# Altium schematic sheet CPU_LPC1776.SchDoc: =ProjectName
size 420 x 297 mm; Author: T.P.; CompanyName: WUT; DrawnBy: T.P.; Organization: WUT ISE; Address1: Warsaw Univeristy of Technology; Address2: Nowowiejska 15/19; DocumentNumber: 2; Revision: 0.9; SheetNumber: 2; SheetTotal: 36; EDA_Number: ARTIQ; Projet: ARTIQ/SINARA; ModifiedBy: -; CreateDate: XX/XX/XXXX; CheckedDate: -; Title2: CPU_LPC1776.SchDoc; DivGrp: ISE; Designer: G.K. and T.P.; ModifiedDate: -; ProjectName: ADC/DAC MEZZANINE
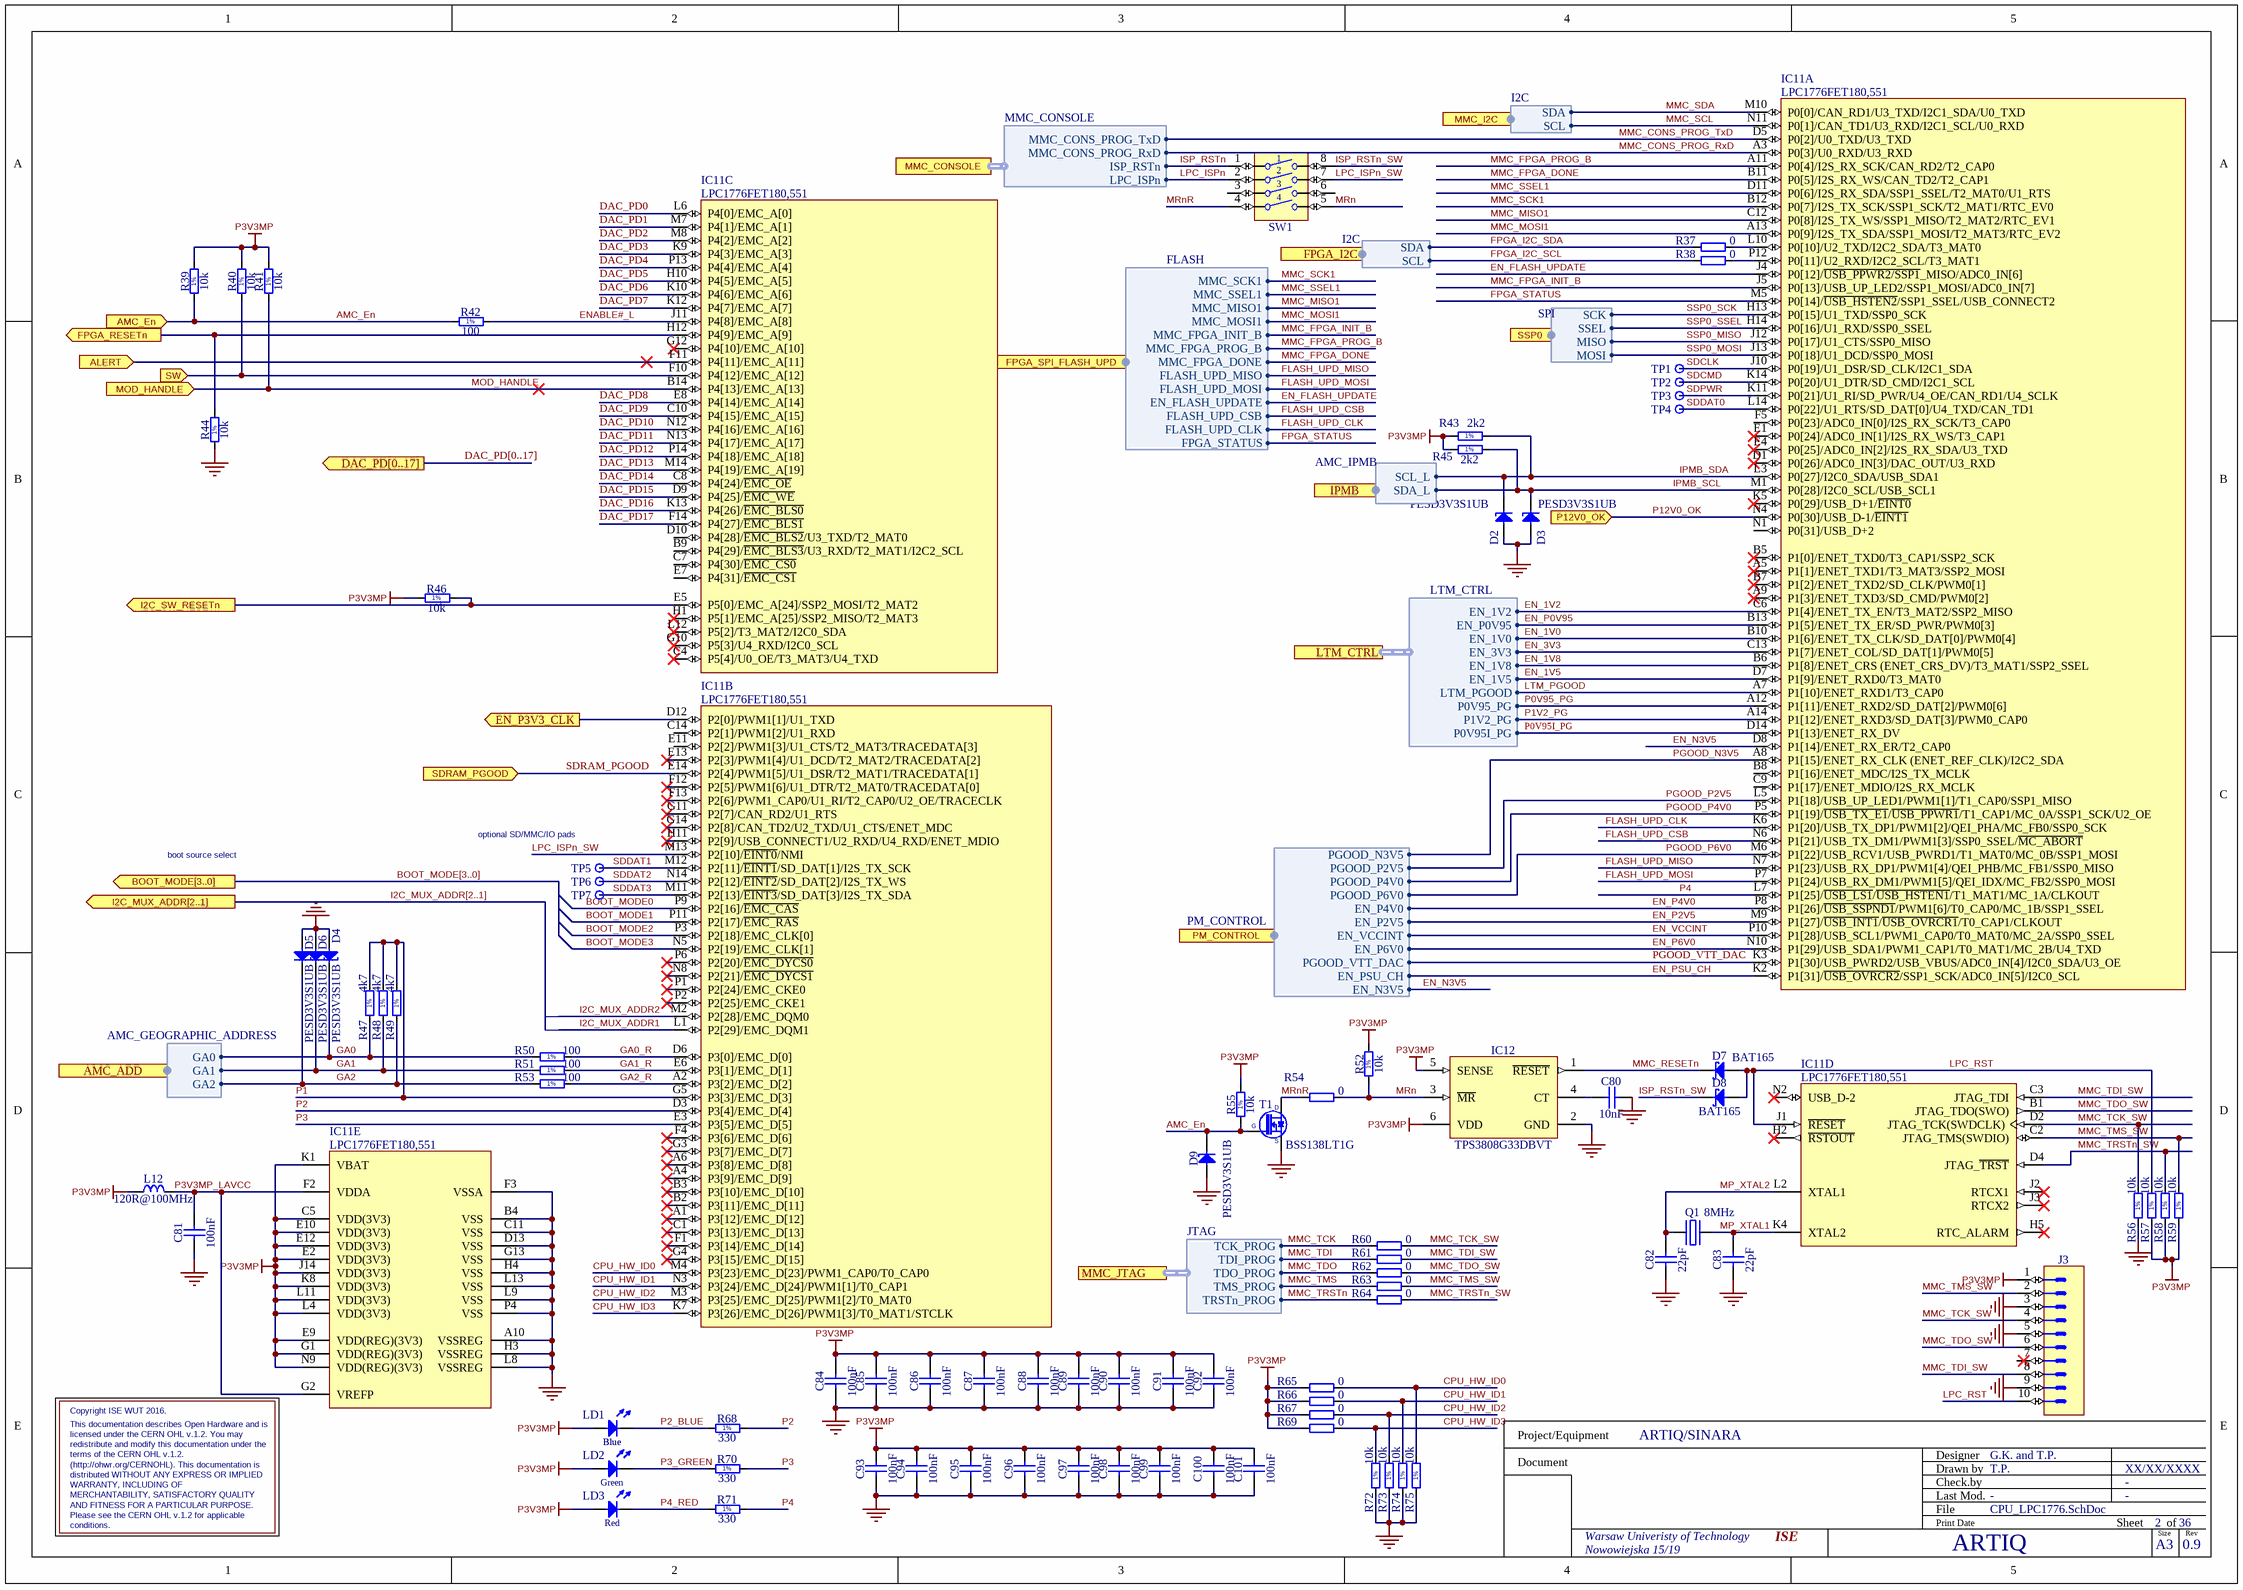
[diagram p0: CPU_LPC1776.SchDoc]

## Parts
C80  10nF  [CAPC1005X55N]
C81  100nF  [CAPC0603X33N]
C82  22pF  [CAPC1005X55N]
C83  22pF  [CAPC1005X55N]
C84  100nF  [CAPC0603X33N]
C85  100nF  [CAPC0603X33N]
C86  100nF  [CAPC0603X33N]
C87  100nF  [CAPC0603X33N]
C88  100nF  [CAPC0603X33N]
C89  100nF  [CAPC0603X33N]
C90  100nF  [CAPC0603X33N]
C91  100nF  [CAPC0603X33N]
C92  100nF  [CAPC0603X33N]
C93  100nF  [CAPC0603X33N]
C94  100nF  [CAPC0603X33N]
C95  100nF  [CAPC0603X33N]
C96  100nF  [CAPC0603X33N]
C97  100nF  [CAPC0603X33N]
C98  100nF  [CAPC0603X33N]
C99  100nF  [CAPC0603X33N]
C100  100nF  [CAPC0603X33N]
C101  100nF  [CAPC0603X33N]
D2  PESD3V3S1UB  [SODFL1608X65N]
D3  PESD3V3S1UB  [SODFL1608X65N]
D4  PESD3V3S1UB  [SODFL1608X65N]
D5  PESD3V3S1UB  [SODFL1608X65N]
D6  PESD3V3S1UB  [SODFL1608X65N]
D7  BAT165  [SOD2512X110N]
D8  BAT165  [SOD2512X110N]
D9  PESD3V3S1UB  [SODFL1608X65N]
IC11  LPC1776FET180,551  [BGA180C80P14X14_1200X1200X120]  (parts A,B,C,D,E of 5)
IC12  TPS3808G33DBVT  [SOT95P280X145-6N]
J3  Header 10  [SAMTEC_FTS-105-02-F-DV]  (value not drawn)
L12  120R@100MHz  [INDC1608X95N]
LD1  Blue  [LED_AVAGO_HSMR-C120]
LD2  Green  [LED_AVAGO_HSME-C120]
LD3  Red  [LED_OSRAM_LS Q976]
Q1  8MHz  [XTAL_TXC_7A]
R37  0  [RESC1005X40N]
R38  0  [RESC1005X40N]
R39  10k  [RESC1005X40N]
R40  10k  [RESC1005X40N]
R41  10k  [RESC1005X40N]
R42  100  [RESC1005X40N]
R43  2k2  [RESC1005X40N]
R44  10k  [RESC1005X40N]
R45  2k2  [RESC1005X40N]
R46  10k  [RESC1005X40N]
R47  4k7  [RESC1005X40N]
R48  4k7  [RESC1005X40N]
R49  4k7  [RESC1005X40N]
R50  100  [RESC1005X40N]
R51  100  [RESC1005X40N]
R52  10k  [RESC1005X40N]
R53  100  [RESC1005X40N]
R54  0  [RESC1005X40N]
R55  10k  [RESC1005X40N]
R56  10k  [RESC1005X40N]
R57  10k  [RESC1005X40N]
R58  10k  [RESC1005X40N]
R59  10k  [RESC1005X40N]
R60  0  [RESC1005X40N]
R61  0  [RESC1005X40N]
R62  0  [RESC1005X40N]
R63  0  [RESC1005X40N]
R64  0  [RESC1005X40N]
R65  0  [RESC1005X40N]
R66  0  [RESC1005X40N]
R67  0  [RESC1005X40N]
R68  330  [RESC1005X40N]
R69  0  [RESC1005X40N]
R70  330  [RESC1005X40N]
R71  330  [RESC1005X40N]
R72  10k  [RESC1005X40N]
R73  10k  [RESC1005X40N]
R74  10k  [RESC1005X40N]
R75  10k  [RESC1005X40N]
SW1  Switch  [SW_TYCO_1571983-4]  (value not drawn)
T1  BSS138LT1G  [SOT95P240X110-3N]
TP1  Test Point  [TPS127]  (value not drawn)
TP2  Test Point  [TPS127]  (value not drawn)
TP3  Test Point  [TPS127]  (value not drawn)
TP4  Test Point  [TPS127]  (value not drawn)
TP5  Test Point  [TPS127]  (value not drawn)
TP6  Test Point  [TPS127]  (value not drawn)
TP7  Test Point  [TPS127]  (value not drawn)

## Ports
ALERT (in), AMC_ADD (harness AMC_GEOGRAPHIC_ADDRESS), AMC_En (in), BOOT_MODE[3..0] (out), DAC_PD[0..17] (out), EN_P3V3_CLK (out), FPGA_I2C (harness I2C), FPGA_RESETn (out), FPGA_SPI_FLASH_UPD (harness FLASH), I2C_MUX_ADDR[2..1] (out), I2C_SW_RESETn (out), IPMB (harness AMC_IPMB), LTM_CTRL (harness LTM_CTRL), MMC_CONSOLE (harness MMC_CONSOLE), MMC_I2C (harness I2C), MMC_JTAG (harness JTAG), MOD_HANDLE (in), P12V0_OK (in), PM_CONTROL (harness PM_CONTROL), SDRAM_PGOOD (in), SSP0 (harness SPI), SW (in)

## Harnesses
I2C: SDA, SCL
AMC_GEOGRAPHIC_ADDRESS: GA0, GA1, GA2
PM_CONTROL: EN_P6V0, EN_PSU_CH, EN_VCCINT, PGOOD_P6V0, EN_P4V0, EN_P2V5, PGOOD_P4V0, PGOOD_P2V5, PGOOD_VTT_DAC, EN_N3V5, PGOOD_N3V5
SPI: SCK, SSEL, MISO, MOSI
FLASH: MMC_SCK1, MMC_SSEL1, MMC_MISO1, MMC_MOSI1, MMC_FPGA_INIT_B, MMC_FPGA_PROG_B, MMC_FPGA_DONE, FLASH_UPD_MISO, FLASH_UPD_MOSI, EN_FLASH_UPDATE, FLASH_UPD_CSB, FLASH_UPD_CLK, FPGA_STATUS
MMC_CONSOLE: MMC_CONS_PROG_RxD, MMC_CONS_PROG_TxD, LPC_ISPn, ISP_RSTn
I2C: SCL, SDA
AMC_IPMB: SCL_L, SDA_L
JTAG: TDO_PROG, TDI_PROG, TCK_PROG, TMS_PROG, TRSTn_PROG
LTM_CTRL: EN_1V0, EN_3V3, EN_1V8, EN_1V5, LTM_PGOOD, EN_1V2, EN_P0V95, P0V95_PG, P1V2_PG, P0V95I_PG

## Nets
GND: C80.1 C81.2 C82.1 C83.1 C84.2 C85.2 C86.2 C87.2 C88.2 C89.2 C90.2 C91.2 C92.2 C93.2 C94.2 C95.2 C96.2 C97.2 C98.2 C99.2 C100.2 C101.2 D2.2(A) D3.2(A) D4.2(A) D5.2(A) D6.2(A) D9.2(A) IC11.A10(VSSREG) IC11.B4(VSS) IC11.C11(VSS) IC11.D13(VSS) IC11.F3(VSSA) IC11.G13(VSS) IC11.H3(VSSREG) IC11.H4(VSS) IC11.L8(VSSREG) IC11.L9(VSS) IC11.L13(VSS) IC11.P4(VSS) IC12.2(GND) J3.3 J3.5 J3.9 R44.1 R56.1 R72.1 R73.1 R74.1 R75.1 T1.2(S)
P3V3MP: C84.1 C85.1 C86.1 C87.1 C88.1 C89.1 C90.1 C91.1 C92.1 C93.1 C94.1 C95.1 C96.1 C97.1 C98.1 C99.1 C100.1 C101.1 IC11.C5(VDD(3V3)) IC11.E2(VDD(3V3)) IC11.E9(VDD(REG)(3V3)) IC11.E10(VDD(3V3)) IC11.E12(VDD(3V3)) IC11.G1(VDD(REG)(3V3)) IC11.J14(VDD(3V3)) IC11.K1(VBAT) IC11.K8(VDD(3V3)) IC11.L4(VDD(3V3)) IC11.L11(VDD(3V3)) IC11.N9(VDD(REG)(3V3)) IC12.5(SENSE) IC12.6(VDD) J3.1 L12.2 LD1.2(A) LD2.2(A) LD3.2(A) R39.2 R40.2 R41.2 R43.1 R45.1 R46.1 R52.2 R55.2 R57.1 R58.1 R59.1 R65.1 R66.1 R67.1 R69.1
ALERT: IC11.F11(P4[11]/EMC_A[11]) ; port ALERT
AMC_En: D9.1(C) R39.1 R42.1 R55.1 T1.1(G) ; port AMC_En
BOOT_MODE0: IC11.P9(P2[16]/~{EMC_CAS})
BOOT_MODE1: IC11.P11(P2[17]/~{EMC_RAS})
BOOT_MODE2: IC11.P3(P2[18]/EMC_CLK[0])
BOOT_MODE3: IC11.N5(P2[19]/EMC_CLK[1])
CPU_HW_ID0: IC11.M4(P3[23]/EMC_D[23]/PWM1_CAP0/T0_CAP0) R65.2 R75.2
CPU_HW_ID1: IC11.N3(P3[24]/EMC_D[24]/PWM1[1]/T0_CAP1) R66.2 R74.2
CPU_HW_ID2: IC11.M3(P3[25]/EMC_D[25]/PWM1[2]/T0_MAT0) R67.2 R73.2
CPU_HW_ID3: IC11.K7(P3[26]/EMC_D[26]/PWM1[3]/T0_MAT1/STCLK) R69.2 R72.2
DAC_PD0: IC11.L6(P4[0]/EMC_A[0])
DAC_PD1: IC11.M7(P4[1]/EMC_A[1])
DAC_PD2: IC11.M8(P4[2]/EMC_A[2])
DAC_PD3: IC11.K9(P4[3]/EMC_A[3])
DAC_PD4: IC11.P13(P4[4]/EMC_A[4])
DAC_PD5: IC11.H10(P4[5]/EMC_A[5])
DAC_PD6: IC11.K10(P4[6]/EMC_A[6])
DAC_PD7: IC11.K12(P4[7]/EMC_A[7])
DAC_PD8: IC11.E8(P4[14]/EMC_A[14])
DAC_PD9: IC11.C10(P4[15]/EMC_A[15])
DAC_PD10: IC11.N12(P4[16]/EMC_A[16])
DAC_PD11: IC11.N13(P4[17]/EMC_A[17])
DAC_PD12: IC11.P14(P4[18]/EMC_A[18])
DAC_PD13: IC11.M14(P4[19]/EMC_A[19])
DAC_PD14: IC11.C8(P4[24]/~{EMC_OE})
DAC_PD15: IC11.D9(P4[25]/~{EMC_WE})
DAC_PD16: IC11.K13(P4[26]/~{EMC_BLS0})
DAC_PD17: IC11.F14(P4[27]/~{EMC_BLS1})
EN_1V0: IC11.B10(P1[6]/ENET_TX_CLK/SD_DAT[0]/PWM0[4]) ; port LTM_CTRL.EN_1V0
EN_1V2: IC11.C6(P1[4]/ENET_TX_EN/T3_MAT2/SSP2_MISO) ; port LTM_CTRL.EN_1V2
EN_1V5: IC11.D7(P1[9]/ENET_RXD0/T3_MAT0) ; port LTM_CTRL.EN_1V5
EN_1V8: IC11.B6(P1[8]/ENET_CRS_(ENET_CRS_DV)/T3_MAT1/SSP2_SSEL) ; port LTM_CTRL.EN_1V8
EN_3V3: IC11.C13(P1[7]/ENET_COL/SD_DAT[1]/PWM0[5]) ; port LTM_CTRL.EN_3V3
EN_FLASH_UPDATE: IC11.J4(P0[12]/~{USB_PPWR2/SSP1}_MISO/ADC0_IN[6]) ; port FPGA_SPI_FLASH_UPD.EN_FLASH_UPDATE
EN_N3V5: IC11.D8(P1[14]/ENET_RX_ER/T2_CAP0) ; port PM_CONTROL.EN_N3V5
EN_P0V95: IC11.B13(P1[5]/ENET_TX_ER/SD_PWR/PWM0[3]) ; port LTM_CTRL.EN_P0V95
EN_P2V5: IC11.M9(P1[27]/~{USB_INT1}/~{USB_OVRCR1}/T0_CAP1/CLKOUT) ; port PM_CONTROL.EN_P2V5
EN_P3V3_CLK: IC11.D12(P2[0]/PWM1[1]/U1_TXD) ; port EN_P3V3_CLK
EN_P4V0: IC11.P8(P1[26]/~{USB_SSPND1}/PWM1[6]/T0_CAP0/MC_1B/SSP1_SSEL) ; port PM_CONTROL.EN_P4V0
EN_P6V0: IC11.N10(P1[29]/USB_SDA1/PWM1_CAP1/T0_MAT1/MC_2B/U4_TXD) ; port PM_CONTROL.EN_P6V0
EN_PSU_CH: IC11.K2(P1[31]/~{USB_OVRCR2}/SSP1_SCK/ADC0_IN[5]/I2C0_SCL) ; port PM_CONTROL.EN_PSU_CH
EN_VCCINT: IC11.P10(P1[28]/USB_SCL1/PWM1_CAP0/T0_MAT0/MC_2A/SSP0_SSEL) ; port PM_CONTROL.EN_VCCINT
ENABLE#_L: IC11.J11(P4[8]/EMC_A[8]) R42.2
FLASH_UPD_CLK: IC11.K6(P1[20]/USB_TX_DP1/PWM1[2]/QEI_PHA/MC_FB0/SSP0_SCK) ; port FPGA_SPI_FLASH_UPD.FLASH_UPD_CLK
FLASH_UPD_CSB: IC11.N6(P1[21]/USB_TX_DM1/PWM1[3]/SSP0_SSEL/~{MC_ABORT}) ; port FPGA_SPI_FLASH_UPD.FLASH_UPD_CSB
FLASH_UPD_MISO: IC11.N7(P1[23]/USB_RX_DP1/PWM1[4]/QEI_PHB/MC_FB1/SSP0_MISO) ; port FPGA_SPI_FLASH_UPD.FLASH_UPD_MISO
FLASH_UPD_MOSI: IC11.P7(P1[24]/USB_RX_DM1/PWM1[5]/QEI_IDX/MC_FB2/SSP0_MOSI) ; port FPGA_SPI_FLASH_UPD.FLASH_UPD_MOSI
FPGA_I2C_SCL: R38.1 ; port FPGA_I2C.SCL
FPGA_I2C_SDA: R37.1 ; port FPGA_I2C.SDA
FPGA_RESETn: IC11.H12(P4[9]/EMC_A[9]) R44.2 ; port FPGA_RESETn
FPGA_STATUS: IC11.M5(P0[14]/~{USB_HSTEN2}/SSP1_SSEL/USB_CONNECT2) ; port FPGA_SPI_FLASH_UPD.FPGA_STATUS
GA0: D4.1(C) R47.1 R50.1 ; port AMC_ADD.GA0
GA0_R: IC11.D6(P3[0]/EMC_D[0]) R50.2
GA1: D6.1(C) R48.1 R51.1 ; port AMC_ADD.GA1
GA1_R: IC11.E6(P3[1]/EMC_D[1]) R51.2
GA2: D5.1(C) R49.1 R53.1 ; port AMC_ADD.GA2
GA2_R: IC11.A2(P3[2]/EMC_D[2]) R53.2
I2C_MUX_ADDR1: IC11.L1(P2[29]/EMC_DQM1)
I2C_MUX_ADDR2: IC11.M2(P2[28]/EMC_DQM0)
I2C_SW_RESETn: IC11.E5(P5[0]/EMC_A[24]/SSP2_MOSI/T2_MAT2) R46.2 ; port I2C_SW_RESETn
IPMB_SCL: D3.1(C) IC11.M1(P0[28]/I2C0_SCL/USB_SCL1) R45.2 ; port IPMB.SDA_L
IPMB_SDA: D2.1(C) IC11.L3(P0[27]/I2C0_SDA/USB_SDA1) R43.2 ; port IPMB.SCL_L
ISP_RSTn: SW1.1 ; port MMC_CONSOLE.ISP_RSTn
ISP_RSTn_SW: D8.1(C) SW1.8
LPC_ISPn: SW1.2 ; port MMC_CONSOLE.LPC_ISPn
LPC_ISPn_SW: IC11.M13(P2[10]/~{EINT0}/NMI) SW1.7
LPC_RST: D7.2(A) D8.2(A) IC11.J1(~{RESET}) J3.10 R57.2
LTM_PGOOD: IC11.A7(P1[10]/ENET_RXD1/T3_CAP0) ; port LTM_CTRL.LTM_PGOOD
MMC_CONS_PROG_RxD: IC11.A3(P0[3]/U0_RXD/U3_RXD) ; port MMC_CONSOLE.MMC_CONS_PROG_RxD
MMC_CONS_PROG_TxD: IC11.D5(P0[2]/U0_TXD/U3_TXD) ; port MMC_CONSOLE.MMC_CONS_PROG_TxD
MMC_FPGA_DONE: IC11.B11(P0[5]/I2S_RX_WS/CAN_TD2/T2_CAP1) ; port FPGA_SPI_FLASH_UPD.MMC_FPGA_DONE
MMC_FPGA_INIT_B: IC11.J5(P0[13]/USB_UP_LED2/SSP1_MOSI/ADC0_IN[7]) ; port FPGA_SPI_FLASH_UPD.MMC_FPGA_INIT_B
MMC_FPGA_PROG_B: IC11.A11(P0[4]/I2S_RX_SCK/CAN_RD2/T2_CAP0) ; port FPGA_SPI_FLASH_UPD.MMC_FPGA_PROG_B
MMC_MISO1: IC11.C12(P0[8]/I2S_TX_WS/SSP1_MISO/T2_MAT2/RTC_EV1) ; port FPGA_SPI_FLASH_UPD.MMC_MISO1
MMC_MOSI1: IC11.A13(P0[9]/I2S_TX_SDA/SSP1_MOSI/T2_MAT3/RTC_EV2) ; port FPGA_SPI_FLASH_UPD.MMC_MOSI1
MMC_RESETn: D7.1(C) IC12.1(~{RESET})
MMC_SCK1: IC11.B12(P0[7]/I2S_TX_SCK/SSP1_SCK/T2_MAT1/RTC_EV0) ; port FPGA_SPI_FLASH_UPD.MMC_SCK1
MMC_SCL: IC11.N11(P0[1]/CAN_TD1/U3_RXD/I2C1_SCL/U0_RXD) ; port MMC_I2C.SCL
MMC_SDA: IC11.M10(P0[0]/CAN_RD1/U3_TXD/I2C1_SDA/U0_TXD) ; port MMC_I2C.SDA
MMC_SSEL1: IC11.D11(P0[6]/I2S_RX_SDA/SSP1_SSEL/T2_MAT0/U1_RTS) ; port FPGA_SPI_FLASH_UPD.MMC_SSEL1
MMC_TCK: R60.1 ; port MMC_JTAG.TCK_PROG
MMC_TCK_SW: IC11.D2(JTAG_TCK(SWDCLK)) J3.4 R56.2 R60.2
MMC_TDI: R61.1 ; port MMC_JTAG.TDI_PROG
MMC_TDI_SW: IC11.C3(JTAG_TDI) J3.8 R61.2
MMC_TDO: R62.1 ; port MMC_JTAG.TDO_PROG
MMC_TDO_SW: IC11.B1(JTAG_TDO(SWO)) J3.6 R62.2
MMC_TMS: R63.1 ; port MMC_JTAG.TMS_PROG
MMC_TMS_SW: IC11.C2(JTAG_TMS(SWDIO)) J3.2 R59.2 R63.2
MMC_TRSTn: R64.1 ; port MMC_JTAG.TRSTn_PROG
MMC_TRSTn_SW: IC11.D4(JTAG_~{TRST}) R58.2 R64.2
MOD_HANDLE: IC11.B14(P4[13]/EMC_A[13]) R41.1 ; port MOD_HANDLE
MP_XTAL1: C83.2 IC11.K4(XTAL2) Q1.2(OSC2)
MP_XTAL2: C82.2 IC11.L2(XTAL1) Q1.1(OSC1)
MRn: IC12.3(~{MR}) R52.1 R54.2 SW1.5
MRnR: R54.1 SW1.4 T1.3(D)
P0V95_PG: IC11.A12(P1[11]/ENET_RXD2/SD_DAT[2]/PWM0[6]) ; port LTM_CTRL.P0V95_PG
P0V95I_PG: IC11.D14(P1[13]/ENET_RX_DV) ; port LTM_CTRL.P0V95I_PG
P1: IC11.G5(P3[3]/EMC_D[3]) R47.2 R48.2 R49.2
P1V2_PG: IC11.A14(P1[12]/ENET_RXD3/SD_DAT[3]/PWM0_CAP0) ; port LTM_CTRL.P1V2_PG
P2: IC11.D3(P3[4]/EMC_D[4]) R68.2
P2_BLUE: LD1.1(C) R68.1
P3: IC11.E3(P3[5]/EMC_D[5]) R70.2
P3_GREEN: LD2.1(C) R70.1
P3V3MP_LAVCC: C81.1 IC11.F2(VDDA) IC11.G2(VREFP) L12.1
P4: IC11.L7(P1[25]/~{USB_LS1}/~{USB_HSTEN1}/T1_MAT1/MC_1A/CLKOUT) R71.2
P4_RED: LD3.1(C) R71.1
P12V0_OK: IC11.N4(P0[30]/USB_D-1/~{EINT1}) ; port P12V0_OK
PGOOD_N3V5: IC11.A8(P1[15]/ENET_RX_CLK_(ENET_REF_CLK)/I2C2_SDA) ; port PM_CONTROL.PGOOD_N3V5
PGOOD_P2V5: IC11.L5(P1[18]/USB_UP_LED1/PWM1[1]/T1_CAP0/SSP1_MISO) ; port PM_CONTROL.PGOOD_P2V5
PGOOD_P4V0: IC11.P5(P1[19]/~{USB_TX_E1}/~{USB_PPWR1}/T1_CAP1/MC_0A/SSP1_SCK/U2_OE) ; port PM_CONTROL.PGOOD_P4V0
PGOOD_P6V0: IC11.M6(P1[22]/USB_RCV1/USB_PWRD1/T1_MAT0/MC_0B/SSP1_MOSI) ; port PM_CONTROL.PGOOD_P6V0
PGOOD_VTT_DAC: IC11.K3(P1[30]/USB_PWRD2/USB_VBUS/ADC0_IN[4]/I2C0_SDA/U3_OE) ; port PM_CONTROL.PGOOD_VTT_DAC
SDCLK: IC11.J10(P0[19]/U1_DSR/SD_CLK/I2C1_SDA) TP1.1
SDCMD: IC11.K14(P0[20]/U1_DTR/SD_CMD/I2C1_SCL) TP2.1
SDDAT0: IC11.L14(P0[22]/U1_RTS/SD_DAT[0]/U4_TXD/CAN_TD1) TP4.1
SDDAT1: IC11.M12(P2[11]/~{EINT1}/SD_DAT[1]/I2S_TX_SCK) TP5.1
SDDAT2: IC11.N14(P2[12]/~{EINT2}/SD_DAT[2]/I2S_TX_WS) TP6.1
SDDAT3: IC11.M11(P2[13]/~{EINT3}/SD_DAT[3]/I2S_TX_SDA) TP7.1
SDPWR: IC11.K11(P0[21]/U1_RI/SD_PWR/U4_OE/CAN_RD1/U4_SCLK) TP3.1
SDRAM_PGOOD: IC11.E14(P2[4]/PWM1[5]/U1_DSR/T2_MAT1/TRACEDATA[1]) ; port SDRAM_PGOOD
SSP0_MISO: IC11.J12(P0[17]/U1_CTS/SSP0_MISO) ; port SSP0.MISO
SSP0_MOSI: IC11.J13(P0[18]/U1_DCD/SSP0_MOSI) ; port SSP0.MOSI
SSP0_SCK: IC11.H13(P0[15]/U1_TXD/SSP0_SCK) ; port SSP0.SCK
SSP0_SSEL: IC11.H14(P0[16]/U1_RXD/SSP0_SSEL) ; port SSP0.SSEL
SW: IC11.F10(P4[12]/EMC_A[12]) R40.1 ; port SW
NetC80_2: C80.2 IC12.4(CT)
NetIC11_L10: IC11.L10(P0[10]/U2_TXD/I2C2_SDA/T3_MAT0) R37.2
NetIC11_P12: IC11.P12(P0[11]/U2_RXD/I2C2_SCL/T3_MAT1) R38.2

Not connected (* = marked no-connect by the designer): IC11 A1(P3[12]/EMC_D[12])* A4(P3[9]/EMC_D[9])* A5(P1[1]/ENET_TXD1/T3_MAT3/SSP2_MOSI)* A6(P3[8]/EMC_D[8])* A9(P1[3]/ENET_TXD3/SD_CMD/PWM0[2])* B2(P3[11]/EMC_D[11])* B3(P3[10]/EMC_D[10])* B5(P1[0]/ENET_TXD0/T3_CAP1/SSP2_SCK)* B7(P1[2]/ENET_TXD2/SD_CLK/PWM0[1])* B8(P1[16]/ENET_MDC/I2S_TX_MCLK) B9(P4[29]/~{EMC_BLS3}/U3_RXD/T2_MAT1/I2C2_SCL) C1(P3[13]/EMC_D[13])* C4(P5[4]/U0_OE/T3_MAT3/U4_TXD)* C7(P4[30]/~{EMC_CS0}) C9(P1[17]/ENET_MDIO/I2S_RX_MCLK) C14(P2[1]/PWM1[2]/U1_RXD) D1(P0[26]/ADC0_IN[3]/DAC_OUT/U3_RXD)* D10(P4[28]/~{EMC_BLS2}/U3_TXD/T2_MAT0) E1(P0[24]/ADC0_IN[1]/I2S_RX_WS/T3_CAP1)* E4(P0[25]/ADC0_IN[2]/I2S_RX_SDA/U3_TXD)* E7(P4[31]/~{EMC_CS1}) E11(P2[2]/PWM1[3]/U1_CTS/T2_MAT3/TRACEDATA[3]) E13(P2[3]/PWM1[4]/U1_DCD/T2_MAT2/TRACEDATA[2])* F1(P3[14]/EMC_D[14])* F4(P3[6]/EMC_D[6])* F5(P0[23]/ADC0_IN[0]/I2S_RX_SCK/T3_CAP0) F12(P2[5]/PWM1[6]/U1_DTR/T2_MAT0/TRACEDATA[0])* F13(P2[6]/PWM1_CAP0/U1_RI/T2_CAP0/U2_OE/TRACECLK)* G3(P3[7]/EMC_D[7])* G4(P3[15]/EMC_D[15])* G10(P5[3]/U4_RXD/I2C0_SCL)* G11(P2[7]/CAN_RD2/U1_RTS)* G12(P4[10]/EMC_A[10])* G14(P2[8]/CAN_TD2/U2_TXD/U1_CTS/ENET_MDC)* H1(P5[1]/EMC_A[25]/SSP2_MISO/T2_MAT3)* H2(~{RSTOUT})* H5(RTC_ALARM)* H11(P2[9]/USB_CONNECT1/U2_RXD/U4_RXD/ENET_MDIO)* J2(RTCX1)* J3(RTCX2)* K5(P0[29]/USB_D+1/~{EINT0})* L12(P5[2]/T3_MAT2/I2C0_SDA)* N1(P0[31]/USB_D+2) N2(USB_D-2)* N8(P2[21]/~{EMC_DYCS1})* P1(P2[24]/EMC_CKE0)* P2(P2[25]/EMC_CKE1)* P6(P2[20]/~{EMC_DYCS0})*; J3 7; SW1 3 6

## Buses and harness runs
bus BOOT_MODE[3..0] = port BOOT_MODE[3..0]
bus DAC_PD[0..17] = port DAC_PD[0..17]
bus I2C_MUX_ADDR[2..1] = port I2C_MUX_ADDR[2..1]

## Notes on the sheet
- boot source select
- optional SD/MMC/IO pads
- Copyright ISE WUT 2016.
- (http://ohwr.org/CERNOHL). This documentation is
- redistribute and modify this documentation under the
- terms of the CERN OHL v.1.2.
- WARRANTY, INCLUDING OF
- distributed WITHOUT ANY EXPRESS OR IMPLIED
- licensed under the CERN OHL v.1.2. You may
- This documentation describes Open Hardware and is
- conditions.
- Please see the CERN OHL v.1.2 for applicable
- AND FITNESS FOR A PARTICULAR PURPOSE.
- MERCHANTABILITY, SATISFACTORY QUALITY
- Project/Equipment
- Document
- Designer
- Drawn by
- Check.by
- File
- Last Mod.
- Print Date
- Sheet
- Size
- A3
- of
- Rev
- (in symbol R0402_2K2_1%_0.0625W_100PPM) 1%
- (in symbol R0402_4K7_1%_0.0625W_100PPM) 1%
- (in symbol R0402_10K_1%_0.0625W_100PPM) 1%
- (in symbol R0402_100R_1%_0.1W_100PPM) 1%
- (in symbol R0402_330R_1%_0.0625W_100PPM) 1%

## Library data of the parts
C80 = CC0402_10NF_16V_10%_X7R: Non-polarised capacitor; Manufacturer: GENERIC; Part Description: SMD Multilayer Chip Ceramic Capacitor; Manufacturer1 Part Number: 223878715636; Tolerance: ±10%; Voltage: 16V; TC: X7R; Manufacturer Part Number: CC0402_10NF_16V_10%_X7R; Part Number: CC0402_10NF_16V_10%_X7R; Value: 10nF; Component Kind: Standard; Component Type: Standard; Pin Count: 2; Status: Not Recommended; Case: 0402; Mounted: Yes; Socket: No; SMD: Yes; Sense: No; Manufacturer1 Example: PHYCOMP; Manufacturer1 ComponentHeight: 0.55mm; HelpURL: \\cern.ch\dfs\Applications\Altium\Datasheets\CC0402_X7R_PHYCOMP.pdf; Author: CERN DEM JLC; CreateDate: 03.12.2007; LatestRevisionDate: 03.12.2007
C81 C84-C101 = CC0201_100NF_6.3V_10%_X5R: Non-polarised capacitor; Manufacturer: GENERIC; Part Description: SMD Multilayer Chip Ceramic Capacitor; Manufacturer1 Part Number: 02016D104KAT2A; Tolerance: ±10%; Voltage: 6.3V; TC: X5R; Manufacturer Part Number: CC0201_100NF_6.3V_10%_X5R; Part Number: CC0201_100NF_6.3V_10%_X5R; Value: 100nF; Component Kind: Standard; Component Type: Standard; Pin Count: 2; Status: Not Recommended; Case: 0201; Mounted: Yes; Socket: No; SMD: Yes; Sense: No; Manufacturer1 Example: AVX; Manufacturer1 ComponentHeight: 0.33mm; HelpURL: \\cern.ch\dfs\Applications\Altium\Datasheets\CC0201_X5R_AVX.pdf; Author: CERN DEM JLC; CreateDate: 03.12.2007; LatestRevisionDate: 03.12.2007
C82 C83 = CC0402_22PF_50V_5%_C0G: Non-polarised capacitor; Manufacturer: GENERIC; Part Description: SMD Multilayer Chip Ceramic Capacitor; Manufacturer1 Part Number: C0402C220J5GACTU; Tolerance: ±5%; Voltage: 50V; TC: C0G/NP0; Manufacturer Part Number: CC0402_22PF_50V_5%_C0G; Part Number: CC0402_22PF_50V_5%_C0G; Value: 22pF; Component Kind: Standard; Component Type: Standard; Pin Count: 2; Status: Preferred; Case: 0402; Mounted: Yes; Socket: No; SMD: Yes; Sense: No; Manufacturer1 Example: KEMET; Manufacturer1 ComponentHeight: 0.55mm; HelpURL: \\cern.ch\dfs\Applications\Altium\Datasheets\CC0805_C0G_KEMET_(Commercial Grade).pdf; Author: CERN DEM JLC; CreateDate: 03.12.2007; LatestRevisionDate: 03.12.2007
D2-D6 D9 = PESD3V3S1UB: ESD protection diode; Manufacturer: NXP SEMICONDUCTORS; Part Description: ESD protection diode (23kV); Voltage: 3V3; Power: 330W; PressFit: No; Bonding: No; Manufacturer Part Number: PESD3V3S1UB; PackageDescription: Ultra Small Outline Diode Flat Lead (SOD-523), Body; 1.2mm L X 0.8mm W X 0.65mm H, IPC Medium Density; Part Number: PESD3V3S1UB; Component Kind: Standard; Component Type: Standard; Device: PESD3V3S1UB; Pin Count: 2; Case: SOD523; Mounted: Yes; Socket: No; SMD: Yes; Sense: No; ComponentHeight: 0.65mm; HelpURL: \\cern.ch\dfs\Applications\Altium\Datasheets\PESD3V3S1UB.pdf; Author: CERN DEM JLC; CreateDate: 29.11.2012; LatestRevisionDate: 29.11.2012
D7 D8 = BAT165: Schottky Diode; Manufacturer: INFINEON; Part Description: Medium Power AF Schottky Diode; Voltage: 40V; Power: 750mA; PressFit: No; Bonding: No; Manufacturer Part Number: BAT165; PackageDescription: Small Outline Diode (SOD-323), 1.70mm W X 1.25mm L X 1.10mm H body,  IPC Medium Density; Part Number: BAT165; Component Kind: Standard; Component Type: Standard; Device: BAT165; Pin Count: 2; Case: SOD323; Mounted: Yes; Socket: No; SMD: Yes; Sense: No; ComponentHeight: 1.1mm; HelpURL: \\cern.ch\dfs\Applications\Altium\Datasheets\BAT165.pdf; Author: CERN DEM JLC; CreateDate: 12.11.2014; LatestRevisionDate: 12.11.2014
IC11 = LPC1776FET180,551: 32-bit ARM Cortex-M3 MCU, 256kB Flash, 80kB SRAM, Ethernet, USB 2.0 Device/Host/OTG, CAN, 12-Bit ADC; Manufacturer: NXP SEMICONDUCTORS; Part Description: Cortex-M3, 32-bit ARM MCU, 256kB Flash, 80kB SRAM, Ethernet, USB 2.0 Device/Host/OTG, CAN, 12-Bit ADC; PressFit: No; Bonding: No; Manufacturer Part Number: LPC1776FET180,551; PackageDescription: BGA, 0.80mm Pitch, Square; 180 Pin, 14 Columns X 14 Rows, Body 12.00mm X 12.00mm X 1.20mm H, IPC Medium Density; Part Number: LPC1776FET180,551; Component Kind: Standard; Component Type: Standard; Device: LPC1776FET180,551; Pin Count: 180; Case: BGA180; Mounted: Yes; Socket: No; SMD: Yes; Sense: No; ComponentHeight: 1.2mm; HelpURL: \\cern.ch\dfs\Applications\Altium\Datasheets\LPC1776FET180,551.pdf; Author: CERN DEM JMW; CreateDate: 16.08.2016; LatestRevisionDate: 16.08.2016
IC12 = TPS3808G33DBVT: Low Quiescent Current, Programmable-Delay Supervisory Circuit; Manufacturer: TEXAS INSTRUMENTS; Part Description: 3.3V, Low Quiescent Current, Programmable-Delay Supervisory Circuit; PressFit: No; Bonding: No; Manufacturer Part Number: TPS3808G33DBVT; PackageDescription: SOT23, 6-Leads, Body 1.6x3.0mm, Pitch 0.95mm, IPC Medium Density; Part Number: TPS3808G33DBVT; Component Kind: Standard; Component Type: Standard; Device: TPS3808G33DBVT; Pin Count: 6; Case: SOT23-6; Mounted: Yes; Socket: No; SMD: Yes; Sense: No; ComponentHeight: 1.45mm; Author: CERN DEM JLC; HelpURL: \\cern.ch\dfs\Applications\Altium\Datasheets\TPS3808G33DBVT.pdf; CreateDate: 05.11.2013; LatestRevisionDate: 05.11.2013
J3 = SAMTEC_FTS-105-02-F-DV: Connector 10 Male; Manufacturer: SAMTEC; Part Description: 10 Contacts, Pitch 1.27mm, Dual Row Surface Mount Straight Strip Header; PressFit: No; Manufacturer Part Number: FTS-105-02-F-DV; Part Number: SAMTEC_FTS-105-02-F-DV; Component Kind: Standard; Component Type: Standard; Pin Count: 10; Family: Header 10; Mounted: Yes; Socket: No; Sense: No; SMD: Yes; Status: None; ComponentHeight: 3.18mm; HelpURL: \\cern.ch\dfs\Applications\Altium\Datasheets\SAMTEC_FTS-105-02-F-DV.pdf; Author: CERN DEM JLC; CreateDate: 16.02.2011; LatestRevisionDate: 28.01.2014
L12 = IND0603_MURATA_BLM18PG121SN1D: Inductor; Manufacturer: MURATA; Part Description: SMD EMIFIL Chip Ferrite Bead; Power: 2A; Resistance: 0.05R; Manufacturer Part Number: BLM18PG121SN1D; Part Number: IND0603_MURATA_BLM18PG121SN1D; Value: 120R@100MHz; Component Kind: Standard; Component Type: Standard; Pin Count: 2; Status: None; Case: 0603; Mounted: Yes; Socket: No; SMD: Yes; Sense: No; ComponentHeight: 0.95mm; HelpURL: \\cern.ch\dfs\Applications\Altium\Datasheets\IND0603_MURATA_BLM18P.pdf; Author: CERN DEM BC; CreateDate: 27.07.2015; LatestRevisionDate: 27.07.2015
LD1 = LED_AVAGO_HSMR-C120: LED Blue 1C 2A; Manufacturer: AVAGO TECHNOLOGIES; Part Description: High Performance Right Angle Chip InGaN Blue LED; PressFit: No; Bonding: No; Manufacturer Part Number: HSMR-C120; PackageDescription: Blue Chip LED, 2-Leads, Body 1.7x1.1mm, Side Emitting Package; Part Number: LED_AVAGO_HSMR-C120; Component Kind: Standard; Component Type: Standard; Color: Blue; Pin Count: 2; Mounted: Yes; Socket: No; SMD: Yes; Sense: No; ComponentHeight: 0.7mm; HelpURL: \\cern.ch\dfs\Applications\Altium\Datasheets\LED_AVAGO_HSMR-C120.pdf; Author: CERN DEM JLC; CreateDate: 07.07.2014; LatestRevisionDate: 07.07.2014
LD2 = LED_AVAGO_HSME-C120: LED Green 1C 2A; Manufacturer: AVAGO TECHNOLOGIES; Part Description: High Performance Right Angle Chip Green LED; PressFit: No; Bonding: No; Manufacturer Part Number: HSME-C120; PackageDescription: Green Chip LED, 2-Leads, Body 1.7x1.1mm, Side Emitting Package; Part Number: LED_AVAGO_HSME-C120; Component Kind: Standard; Component Type: Standard; Color: Green; Pin Count: 2; Mounted: Yes; Socket: No; SMD: Yes; Sense: No; ComponentHeight: 0.7mm; HelpURL: \\cern.ch\dfs\Applications\Altium\Datasheets\LED_AVAGO_HSME-C120.pdf; ComponentLink1URL: \\cern.ch\dfs\Applications\Altium\Datasheets\LED_AVAGO_HSME-C110_DESIGN-GUIDE.pdf; ComponentLink1Description: Design Guide; Author: CERN DEM JMW; CreateDate: 22.07.2009; LatestRevisionDate: 20.06.2012
LD3 = LED_OSRAM_LS Q976-NR-1: LED Red 1C 2A; Manufacturer: OSRAM; Part Description: CHIPLED Super Red LED (0603 Case); PressFit: No; Bonding: No; Manufacturer Part Number: LS Q976-NR-1; PackageDescription: Chip Super Red LED, 2-Leads, Body 1.6x0.8mm; Part Number: LED_OSRAM_LS Q976-NR-1; Component Kind: Standard; Component Type: Standard; Color: Red; Pin Count: 2; Case: 0806; Mounted: Yes; Socket: No; SMD: Yes; Sense: No; ComponentHeight: 0.8mm; HelpURL: \\cern.ch\dfs\Applications\Altium\Datasheets\LED_OSRAM_LS Q976-NR-1.pdf; Author: CERN DEM JLC; CreateDate: 12.11.2014; LatestRevisionDate: 12.11.2014
Q1 = XTAL_8MHZ_TXC_7A-8.000MAAE-T: Quartz Crystal; Manufacturer: TXC CORPORATION; Part Description: Tolerance: ±30ppm, Stability: ±30ppm, -20°C to +70°C, 12pF, SMD Glass Seam Sealing Crystal, 7A Series; PressFit: No; Bonding: No; Manufacturer Part Number: 7A-8.000MAAE-T; PackageDescription: 2 Pins, 3.2x5mm, SMD Glass Seam Sealing Crystal, 7A Serie; Part Number: XTAL_8MHZ_TXC_7A-8.000MAAE-T; Value: 8MHz; Component Kind: Standard; Component Type: Standard; Pin Count: 2; Mounted: Yes; Socket: No; SMD: Yes; Sense: No; ComponentHeight: 1.2mm; HelpURL: \\cern.ch\dfs\Applications\Altium\Datasheets\XTAL_TXC_7A.pdf; Author: CERN DEM JLC; CreateDate: 09.10.2014; LatestRevisionDate: 12.11.2014
R37 R38 R54 R60-R67 R69 = R0402_0R_JUMPER: Resistor; Manufacturer: GENERIC; Part Description: 1A (0.05R Max DC Resistance) Zero Ohm Jumper; Manufacturer1 Part Number: 232270591001L; PressFit: No; Manufacturer Part Number: R0402_0R_JUMPER; Part Number: R0402_0R_JUMPER; Value: 0; Component Kind: Standard; Component Type: Standard; Pin Count: 2; Status: Not Recommended; Case: 0402; Mounted: Yes; Sense: No; Socket: No; SMD: Yes; Manufacturer1 Example: YAGEO PHYCOMP; Manufacturer1 ComponentHeight: 0.4mm; HelpURL: \\cern.ch\dfs\Applications\Altium\Datasheets\R0402_Phycomp_RC0402.pdf; Author: CERN DEM JLC; CreateDate: 03.12.2007; LatestRevisionDate: 17.10.2012
R39-R41 R44 R46 R52 R55-R59 R72-R75 = R0402_10K_1%_0.0625W_100PPM: Resistor - 1%; Manufacturer: GENERIC; Part Description: General Purpose Thick Film Chip Resistor; Manufacturer1 Part Number: 232270671003L; TC: ±100ppm/°C; PressFit: No; Manufacturer Part Number: R0402_10K_1%_0.0625W_100PPM; Part Number: R0402_10K_1%_0.0625W_100PPM; Tolerance: ±1%; Value: 10k; Component Kind: Standard; Component Type: Standard; Pin Count: 2; Status: Not Recommended; Power: 0.0625W; Case: 0402; Mounted: Yes; Sense: No; Socket: No; SMD: Yes; Manufacturer1 Example: YAGEO PHYCOMP; Manufacturer1 ComponentHeight: 0.4mm; HelpURL: \\cern.ch\dfs\Applications\Altium\Datasheets\R0402_Phycomp_RC0402.pdf; Author: CERN DEM JLC; CreateDate: 03.12.2007; LatestRevisionDate: 17.10.2012
R42 R50 R51 R53 = R0402_100R_1%_0.1W_100PPM: Resistor - 1%; Manufacturer Part Number: R0402_100R_1%_0.1W_100PPM_50V; Manufacturer: GENERIC; Part Description: General Purpose Thick Film Chip Resistor; Manufacturer1 Part Number: ERJ2RKF1000X; Power: 0.1W; TC: ±100ppm/°C; Voltage: 50V; PressFit: No; Part Number: R0402_100R_1%_0.1W_100PPM; Tolerance: ±1%; Value: 100; Component Kind: Standard; Component Type: Standard; Pin Count: 2; Status: Not Recommended; Case: 0402; Mounted: Yes; Sense: No; Socket: No; SMD: Yes; Manufacturer1 Example: PANASONIC; Manufacturer1 ComponentHeight: 0.4mm; HelpURL: \\cern.ch\dfs\Applications\Altium\Datasheets\R0402_PANASONIC_ERJ2RK.pdf; Author: CERN DEM JLC; CreateDate: 12.12.2013; LatestRevisionDate: 03.03.2015
R43 R45 = R0402_2K2_1%_0.0625W_100PPM: Resistor - 1%; Manufacturer: GENERIC; Part Description: General Purpose Thick Film Chip Resistor; Manufacturer1 Part Number: 232270672202L; TC: ±100ppm/°C; PressFit: No; Manufacturer Part Number: R0402_2K2_1%_0.0625W_100PPM; Part Number: R0402_2K2_1%_0.0625W_100PPM; Tolerance: ±1%; Value: 2k2; Component Kind: Standard; Component Type: Standard; Pin Count: 2; Status: Not Recommended; Power: 0.0625W; Case: 0402; Mounted: Yes; Sense: No; Socket: No; SMD: Yes; Manufacturer1 Example: YAGEO PHYCOMP; Manufacturer1 ComponentHeight: 0.4mm; HelpURL: \\cern.ch\dfs\Applications\Altium\Datasheets\R0402_Phycomp_RC0402.pdf; Author: CERN DEM JLC; CreateDate: 03.12.2007; LatestRevisionDate: 17.10.2012
R47-R49 = R0402_4K7_1%_0.0625W_100PPM: Resistor - 1%; Manufacturer: GENERIC; Part Description: General Purpose Thick Film Chip Resistor; Manufacturer1 Part Number: 232270674702L; TC: ±100ppm/°C; PressFit: No; Manufacturer Part Number: R0402_4K7_1%_0.0625W_100PPM; Part Number: R0402_4K7_1%_0.0625W_100PPM; Tolerance: ±1%; Value: 4k7; Component Kind: Standard; Component Type: Standard; Pin Count: 2; Status: Not Recommended; Power: 0.0625W; Case: 0402; Mounted: Yes; Sense: No; Socket: No; SMD: Yes; Manufacturer1 Example: YAGEO PHYCOMP; Manufacturer1 ComponentHeight: 0.4mm; HelpURL: \\cern.ch\dfs\Applications\Altium\Datasheets\R0402_Phycomp_RC0402.pdf; Author: CERN DEM JLC; CreateDate: 03.12.2007; LatestRevisionDate: 17.10.2012
R68 R70 R71 = R0402_330R_1%_0.0625W_100PPM: Resistor - 1%; Manufacturer: GENERIC; Part Description: General Purpose Thick Film Chip Resistor; Manufacturer1 Part Number: 232270673301L; TC: ±100ppm/°C; PressFit: No; Manufacturer Part Number: R0402_330R_1%_0.0625W_100PPM; Part Number: R0402_330R_1%_0.0625W_100PPM; Tolerance: ±1%; Value: 330; Component Kind: Standard; Component Type: Standard; Pin Count: 2; Status: Not Recommended; Power: 0.0625W; Case: 0402; Mounted: Yes; Sense: No; Socket: No; SMD: Yes; Manufacturer1 Example: YAGEO PHYCOMP; Manufacturer1 ComponentHeight: 0.4mm; HelpURL: \\cern.ch\dfs\Applications\Altium\Datasheets\R0402_Phycomp_RC0402.pdf; Author: CERN DEM JLC; CreateDate: 03.12.2007; LatestRevisionDate: 17.10.2012
SW1 = SW_TYCO_1571983-4: 4 Ways SPST DIP Switch; Part Description: 4 Way SPST SMD DIP Switch, Latched, Contact Rating 0.025A 24VDC; Manufacturer: TYCO; Manufacturer Part Number: 1571983-4 or GDH04S04; PressFit: No; Part Number: SW_TYCO_1571983-4; Component Kind: Standard; Component Type: Standard; Pin Count: 8; PackageDescription: Pitch 1.27mm,  Body 6.2x6.2mm, 4 Ways SPST Surface-Mount DIP Switch, TYCO GDH Series; Family: Switch; Mounted: Yes; Socket: No; SMD: Yes; Sense: No; Status: None; ComponentHeight: 2.31mm; HelpURL: \\cern.ch\dfs\Applications\Altium\Datasheets\SW_TYCO_1571983-4.pdf; Author: CERN DEM JLC; CreateDate: 08.01.2009; LatestRevisionDate: 08.01.2009
T1 = BSS138LT1G: N-CHANNEL MOSFET WITH DIODE; Manufacturer: ON SEMICONDUCTOR; Part Description: 50V 200mA N-Channel Enhancement Mode Field-Effect Transistor; PressFit: No; Bonding: No; Manufacturer Part Number: BSS138LT1G; PackageDescription: SOT23 3-Leads, Pitch 0.95mm - Body 1.4x3mm, IPC Medium Density; Part Number: BSS138LT1G; Component Kind: Standard; Component Type: Standard; Device: BSS138LT1G; Pin Count: 3; Case: SOT23-3; Mounted: Yes; Socket: No; SMD: Yes; Sense: No; ComponentHeight: 1.11mm; HelpURL: \\cern.ch\dfs\Applications\Altium\Datasheets\BSS138LT1G.pdf; Author: CERN DEM JLC; CreateDate: 23.03.2009; LatestRevisionDate: 23.03.2009
TP1-TP7 = SMD_PAD_1.27X1.27MM: Part Description: 1.27mm x 1.27mm PCB Copper Area (SMD Test Point); Mounted: No; Part Number: SMD_PAD_1.27X1.27MM; Component Kind: Standard (No BOM); Component Type: Standard (No BOM); Pin Count: 1; Family: Test Point; Socket: No; SMD: Yes; Sense: No; Status: None; ComponentHeight: 0mm; HelpURL: Undefined; Author: CERN DEM JLC; CreateDate: 12.01.2008; LatestRevisionDate: 12.01.2008; PackageDescription: 1.27mm x 1.27mm PCB Copper Area (SMD Test Point)